# EAGLE schematic Max10-Brd-v1 (EAGLE 9.2.2)
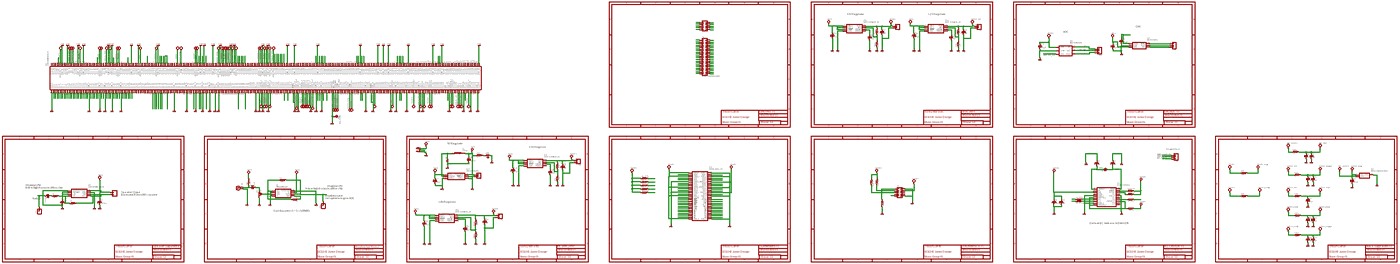
[diagram p0: schematic, sheet 1, overview]
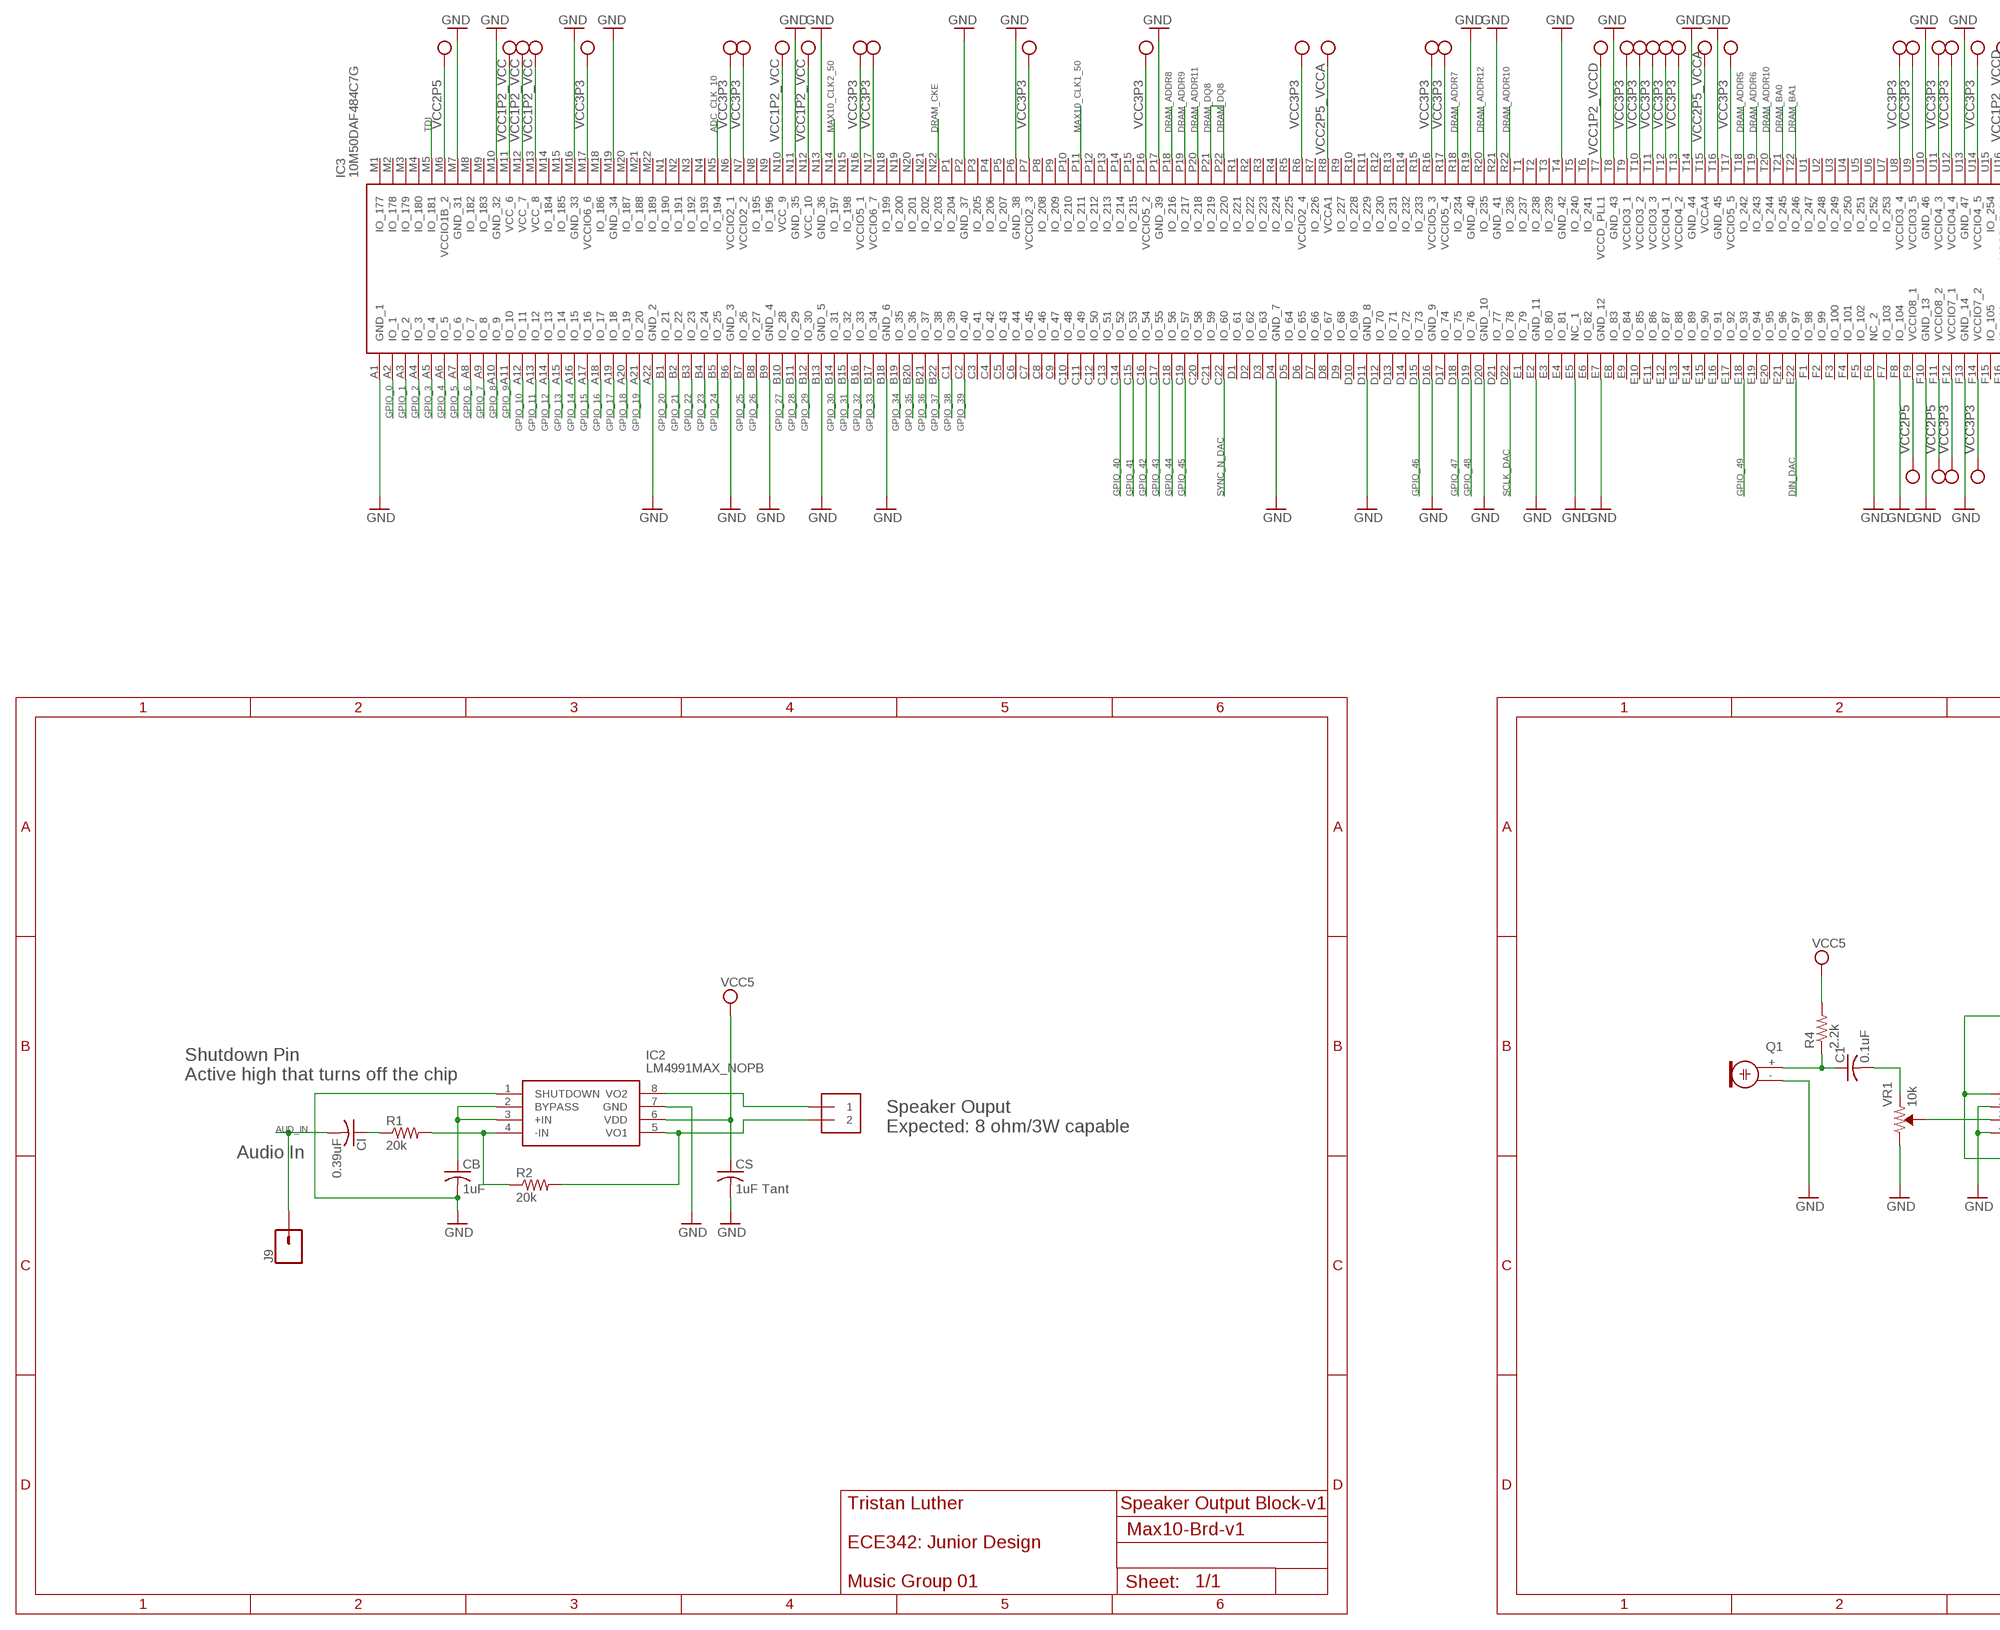
[diagram p1: schematic, sheet 1, part 1 of 6]
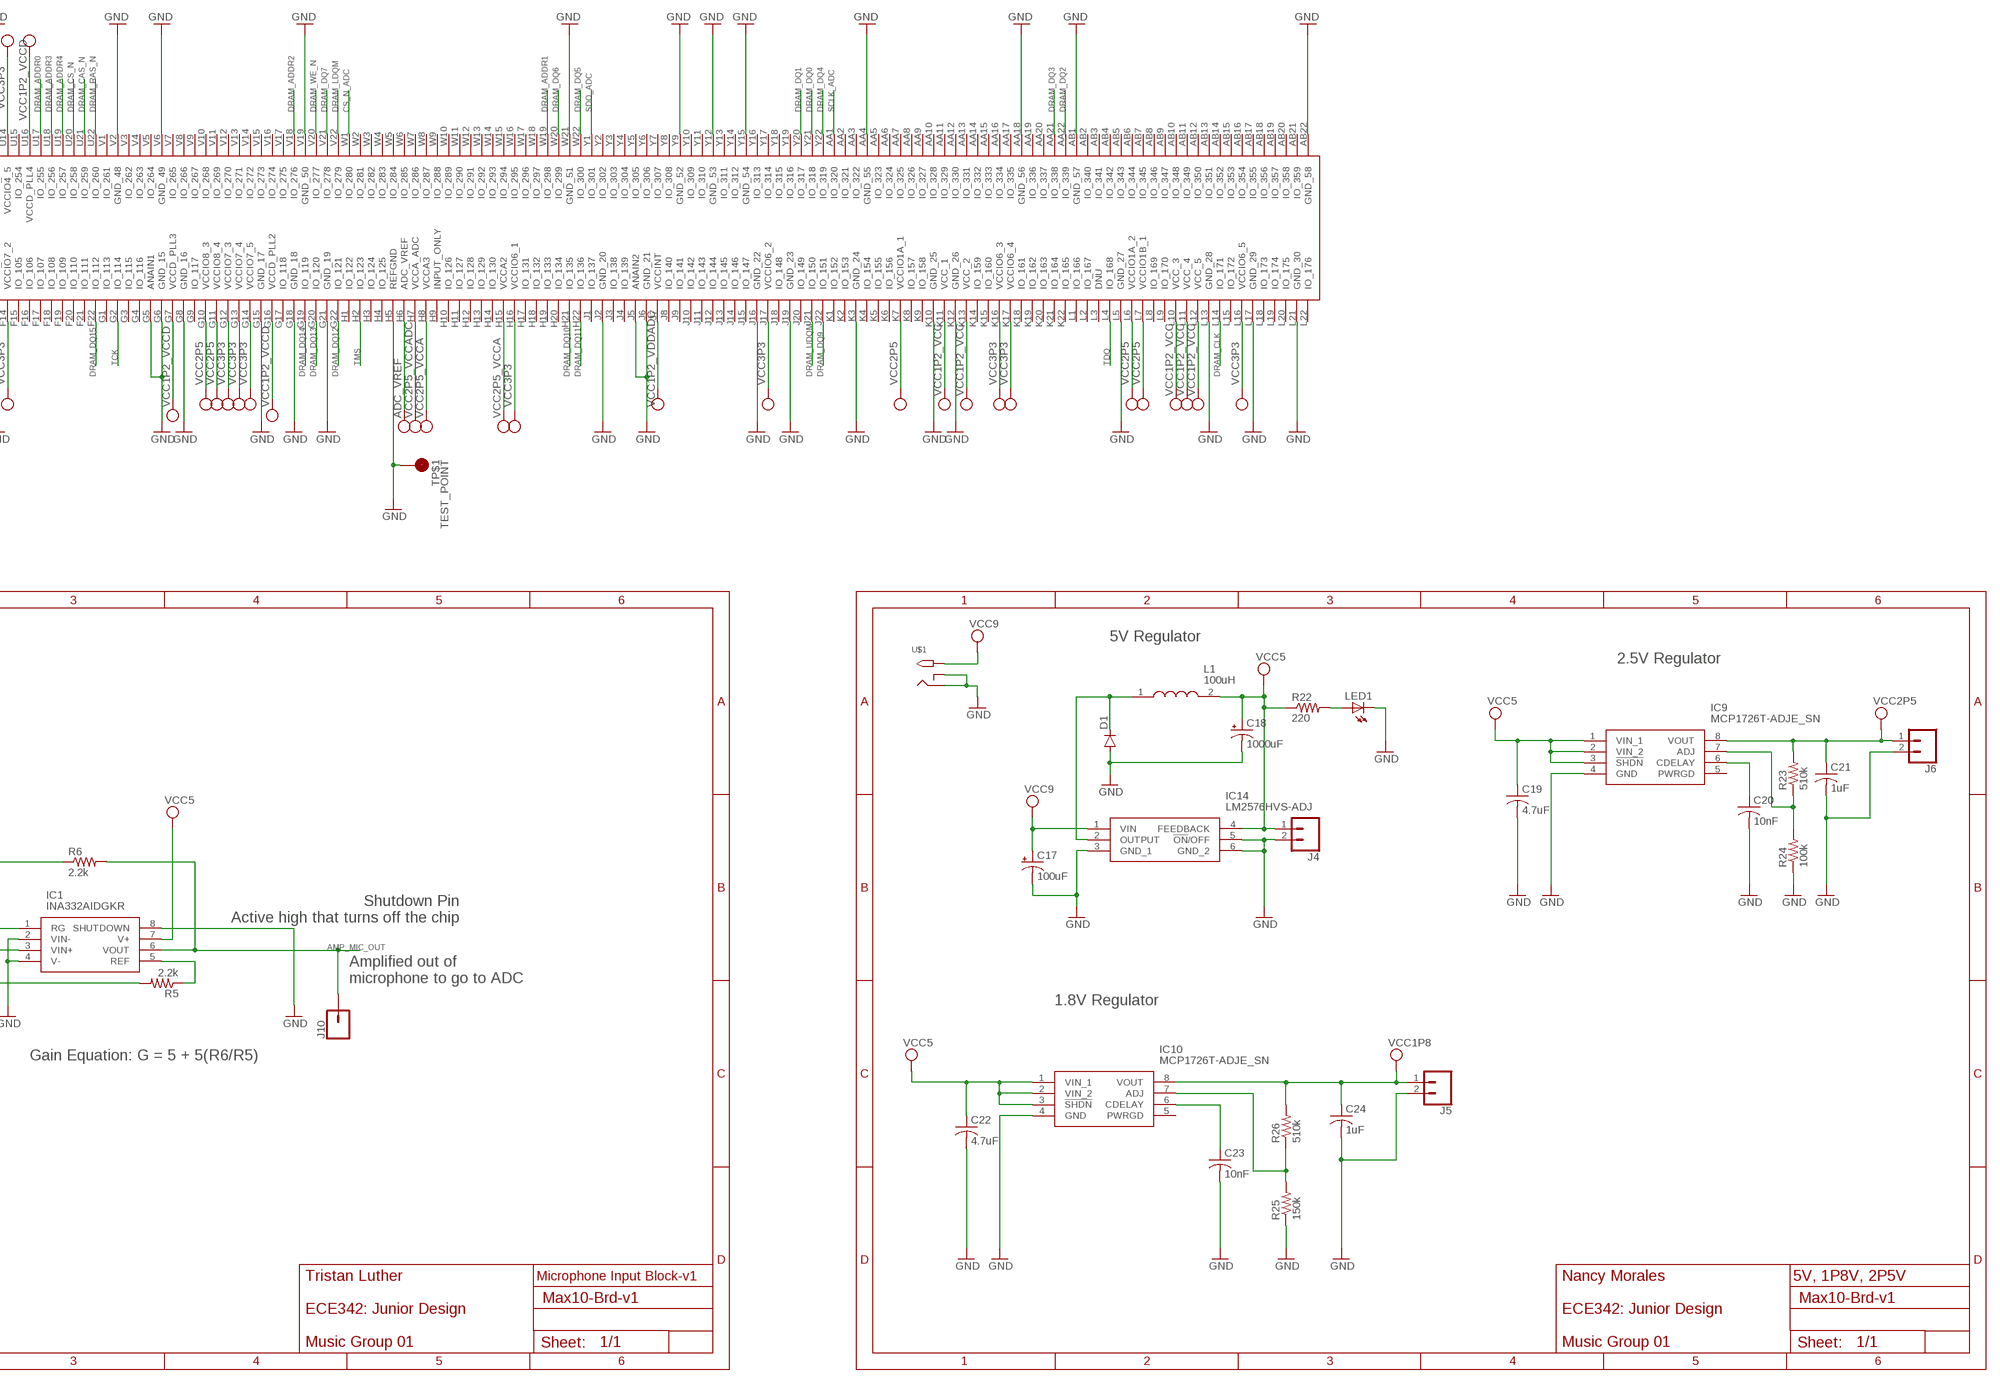
[diagram p2: schematic, sheet 1, part 2 of 6]
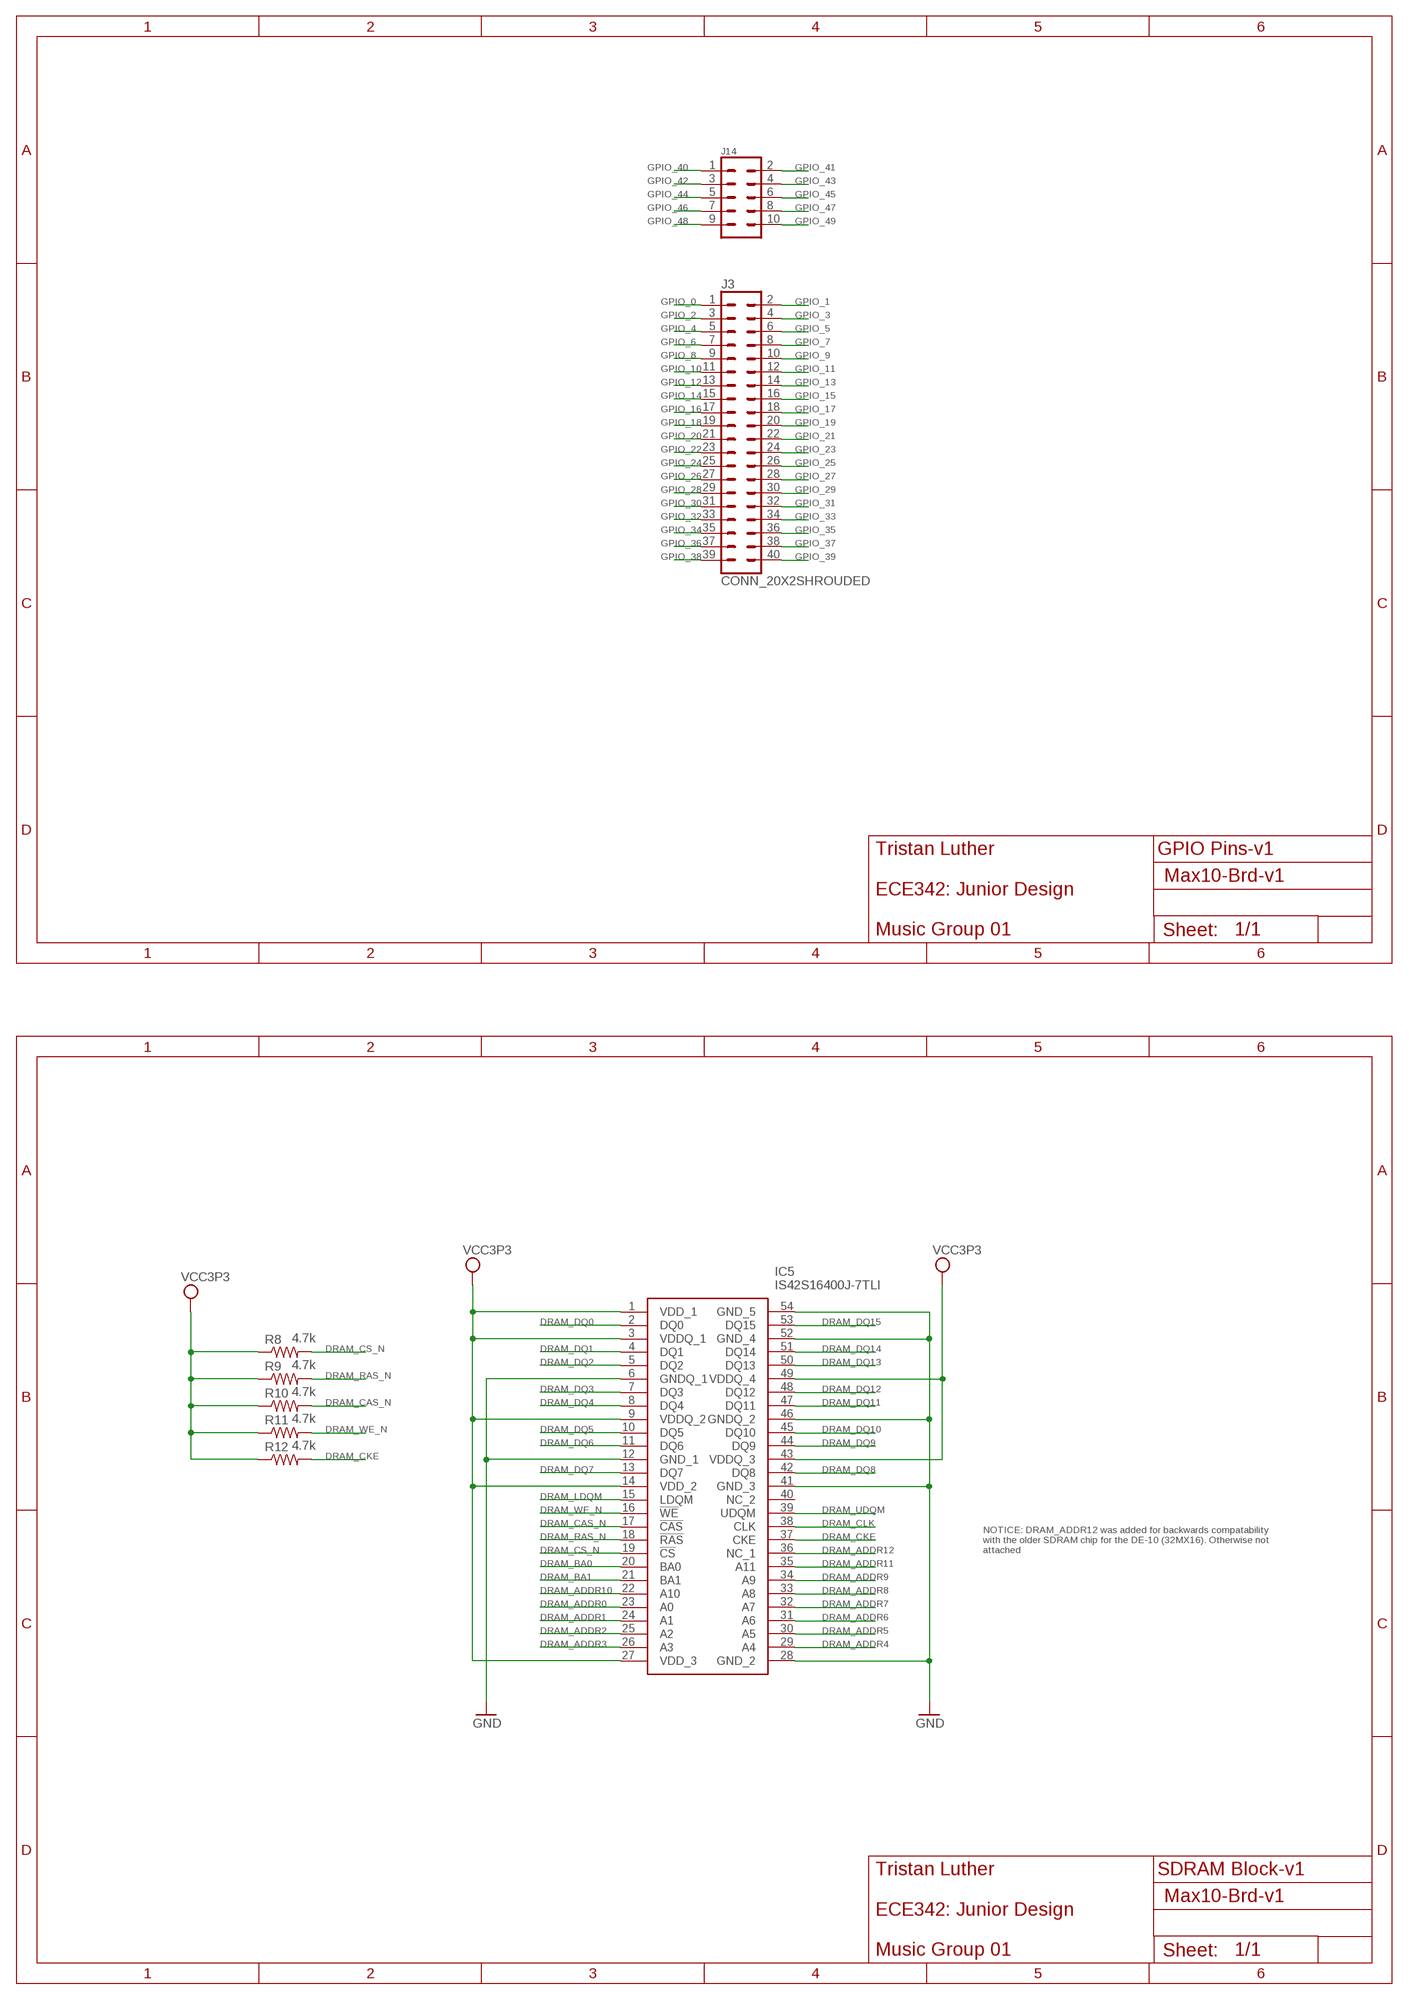
[diagram p3: schematic, sheet 1, part 3 of 6]
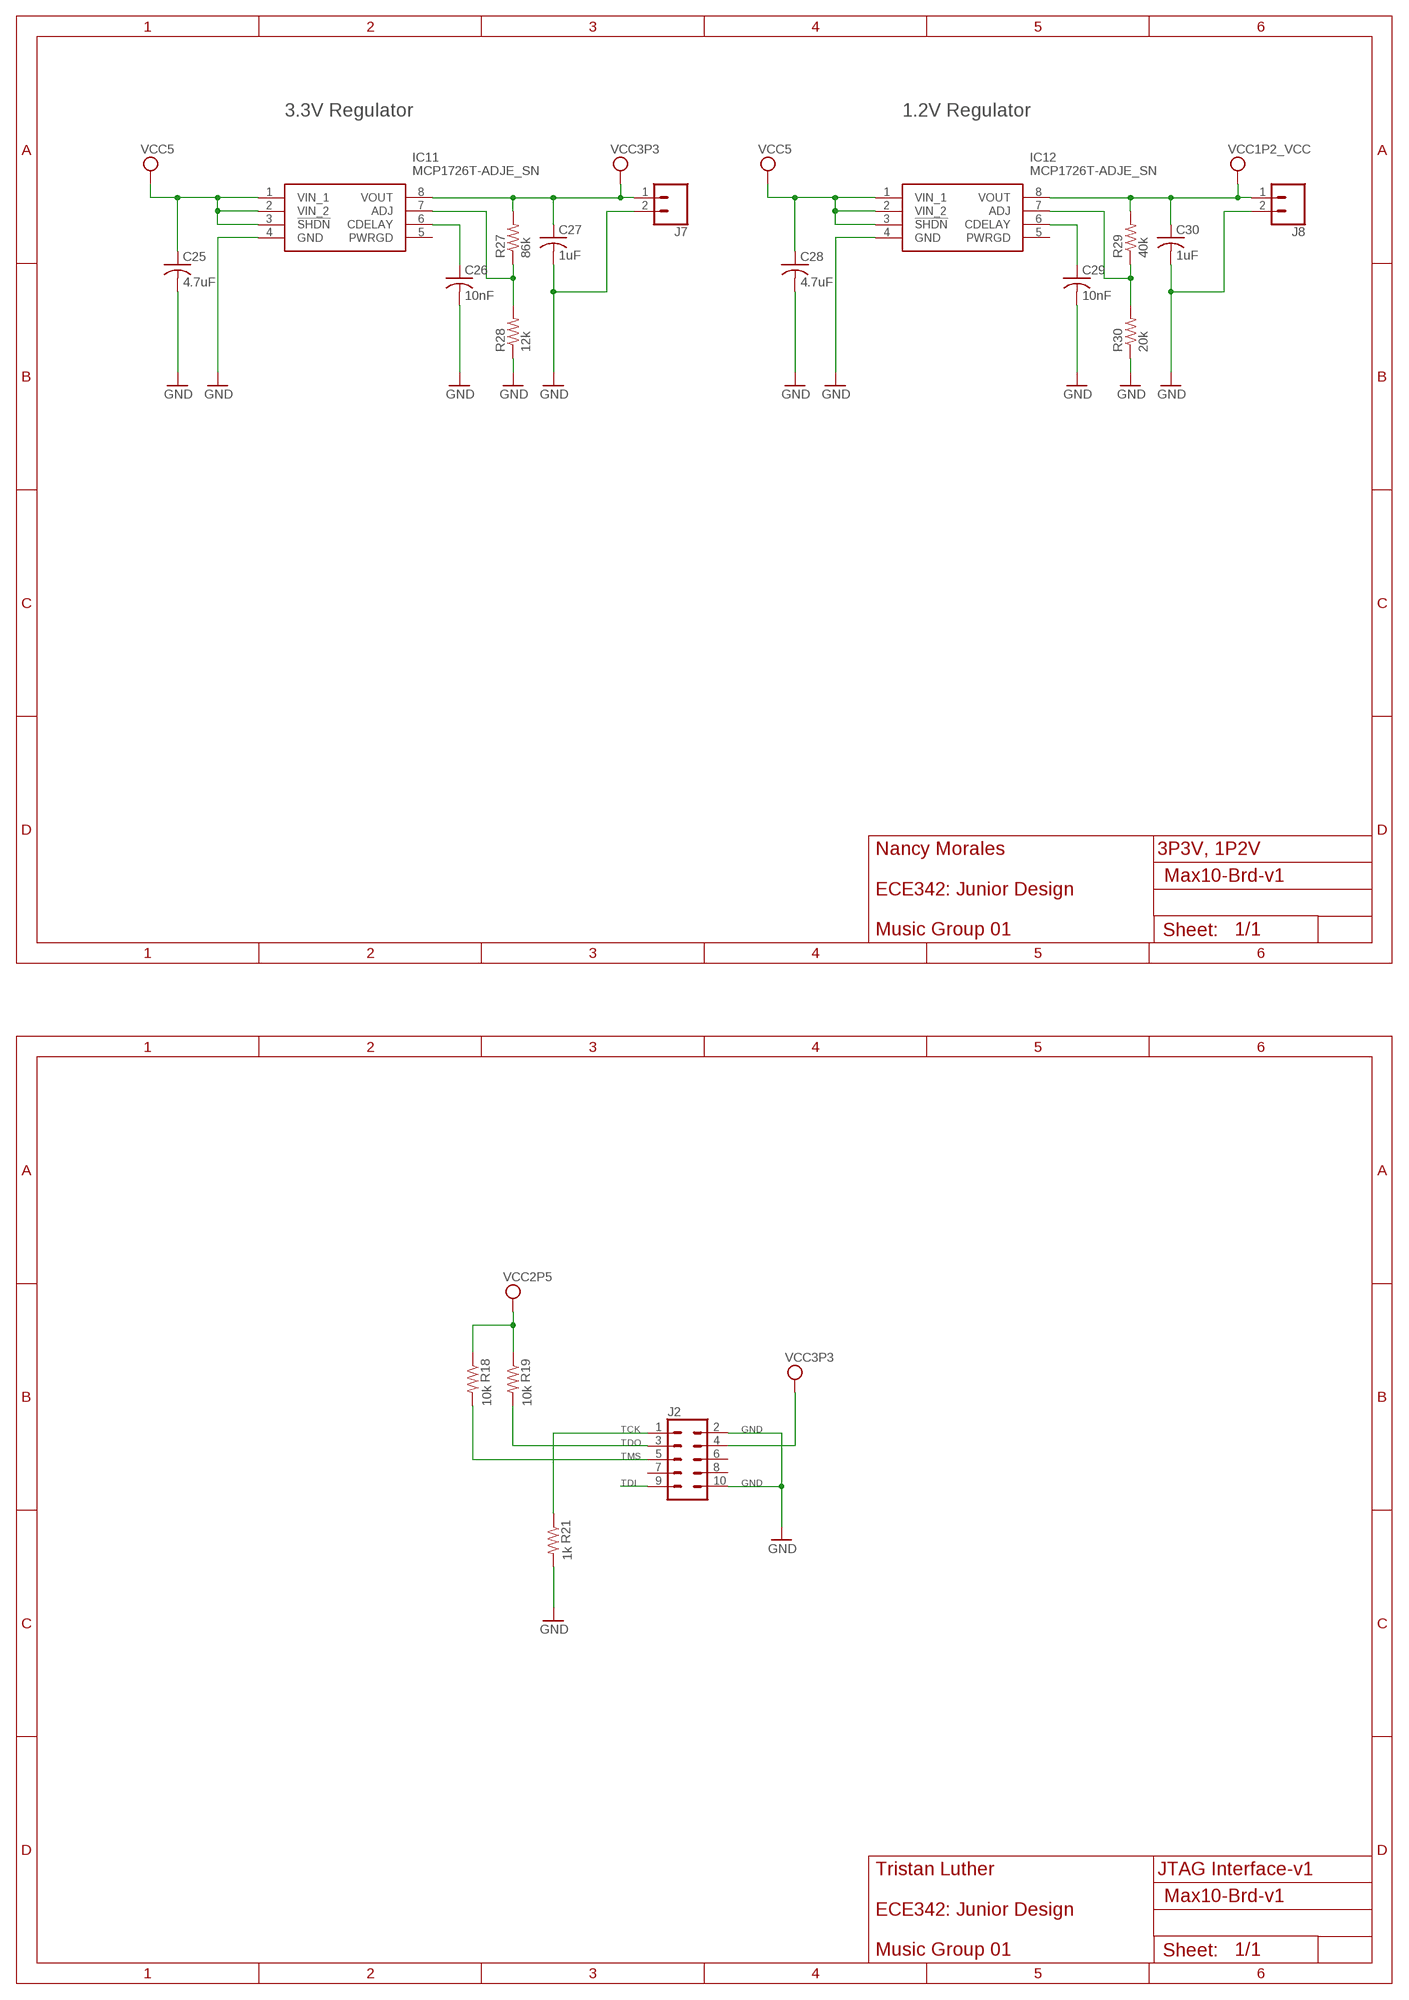
[diagram p4: schematic, sheet 1, part 4 of 6]
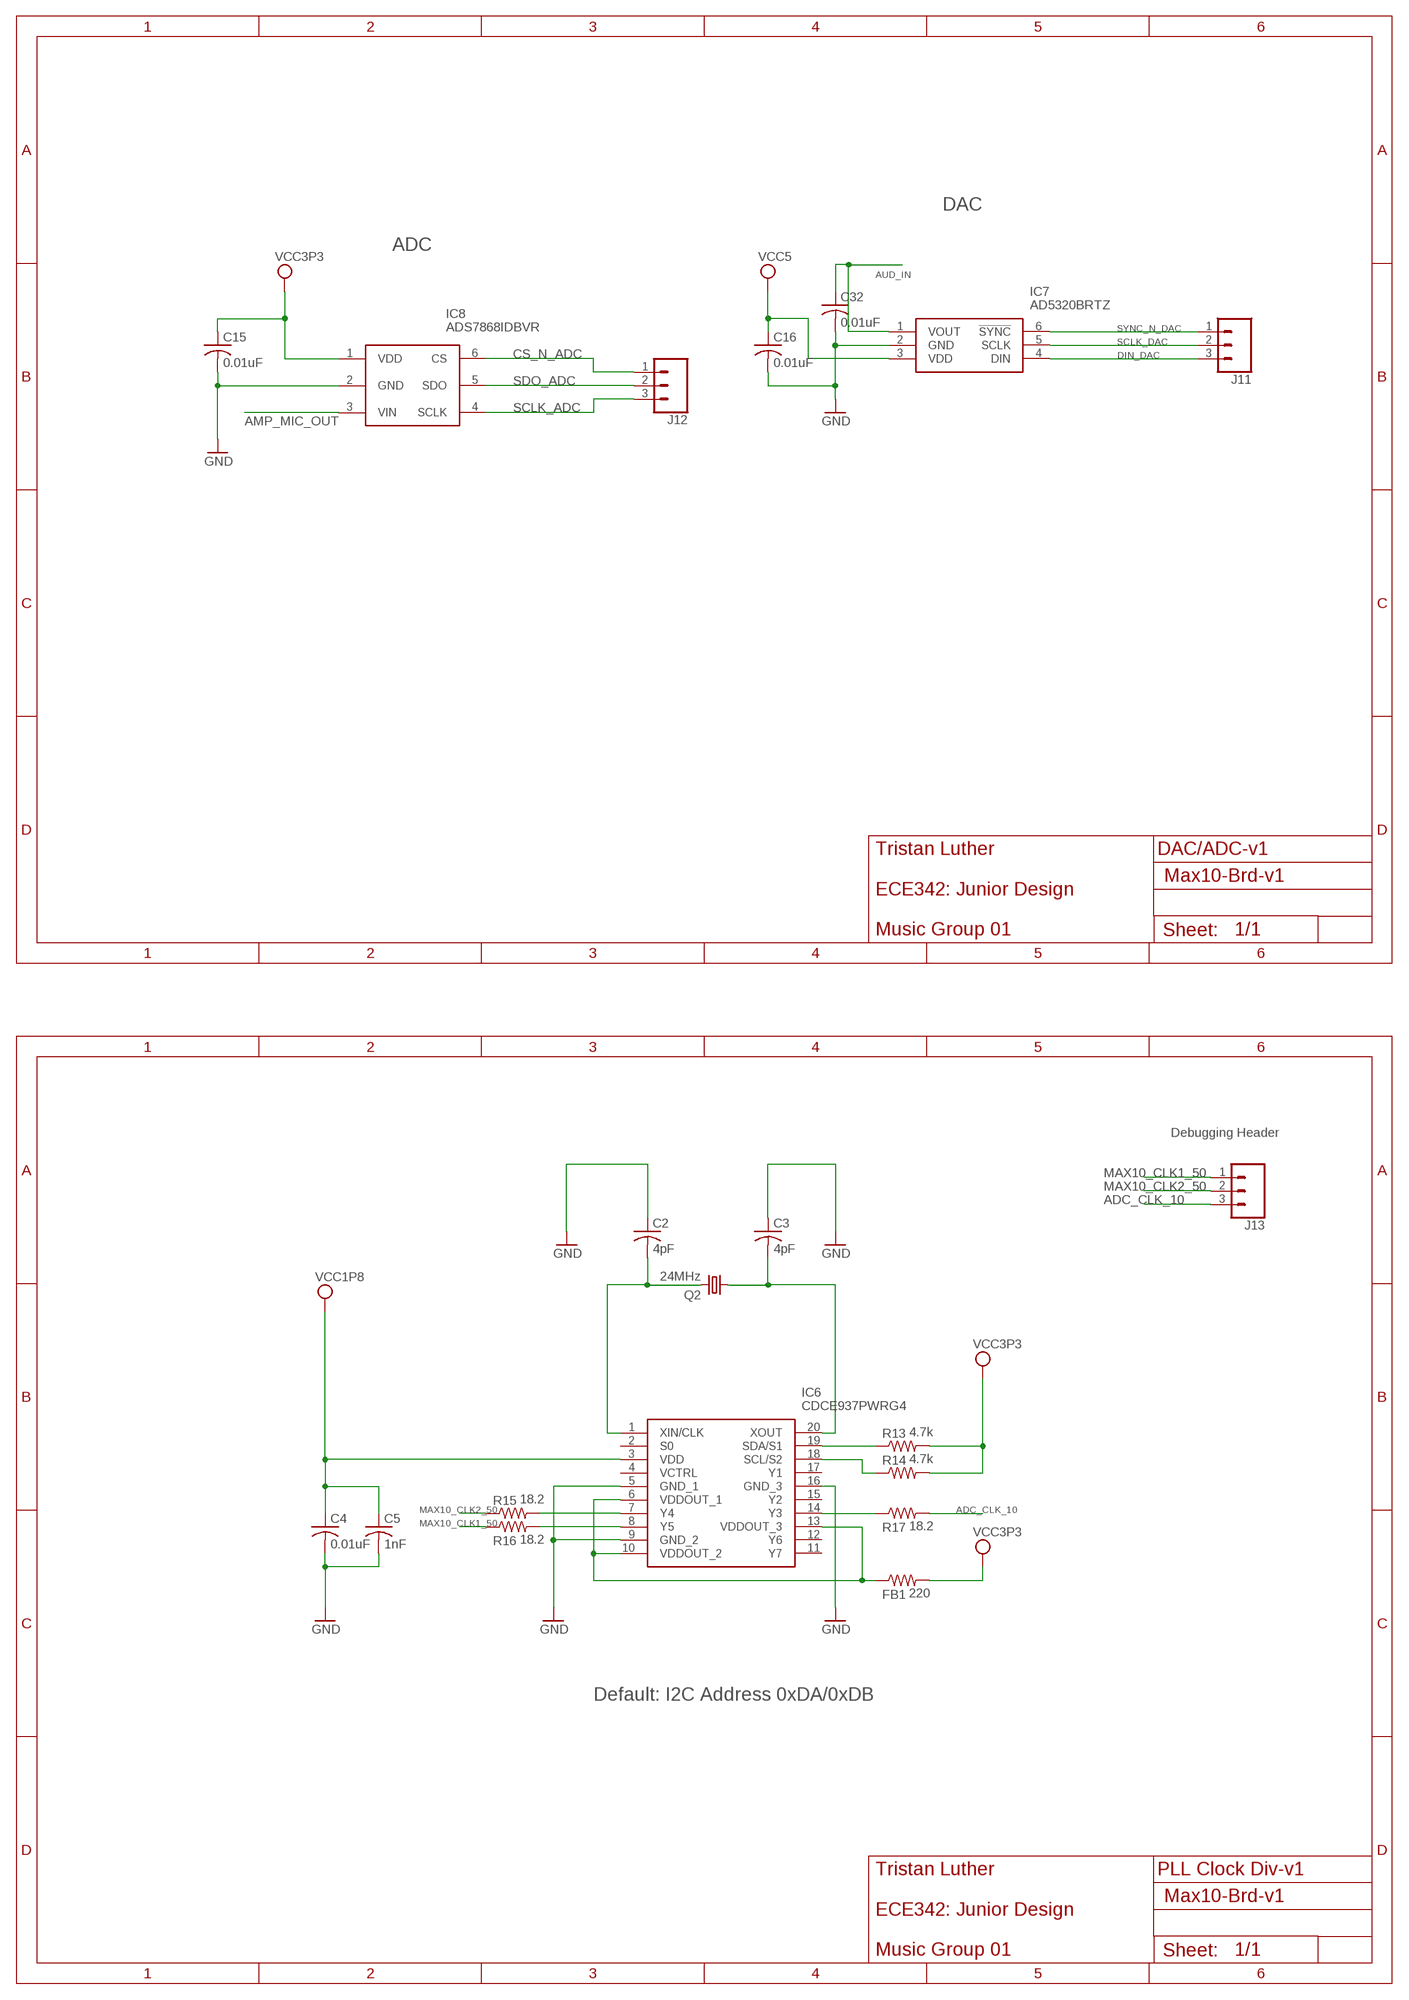
[diagram p5: schematic, sheet 1, part 5 of 6]
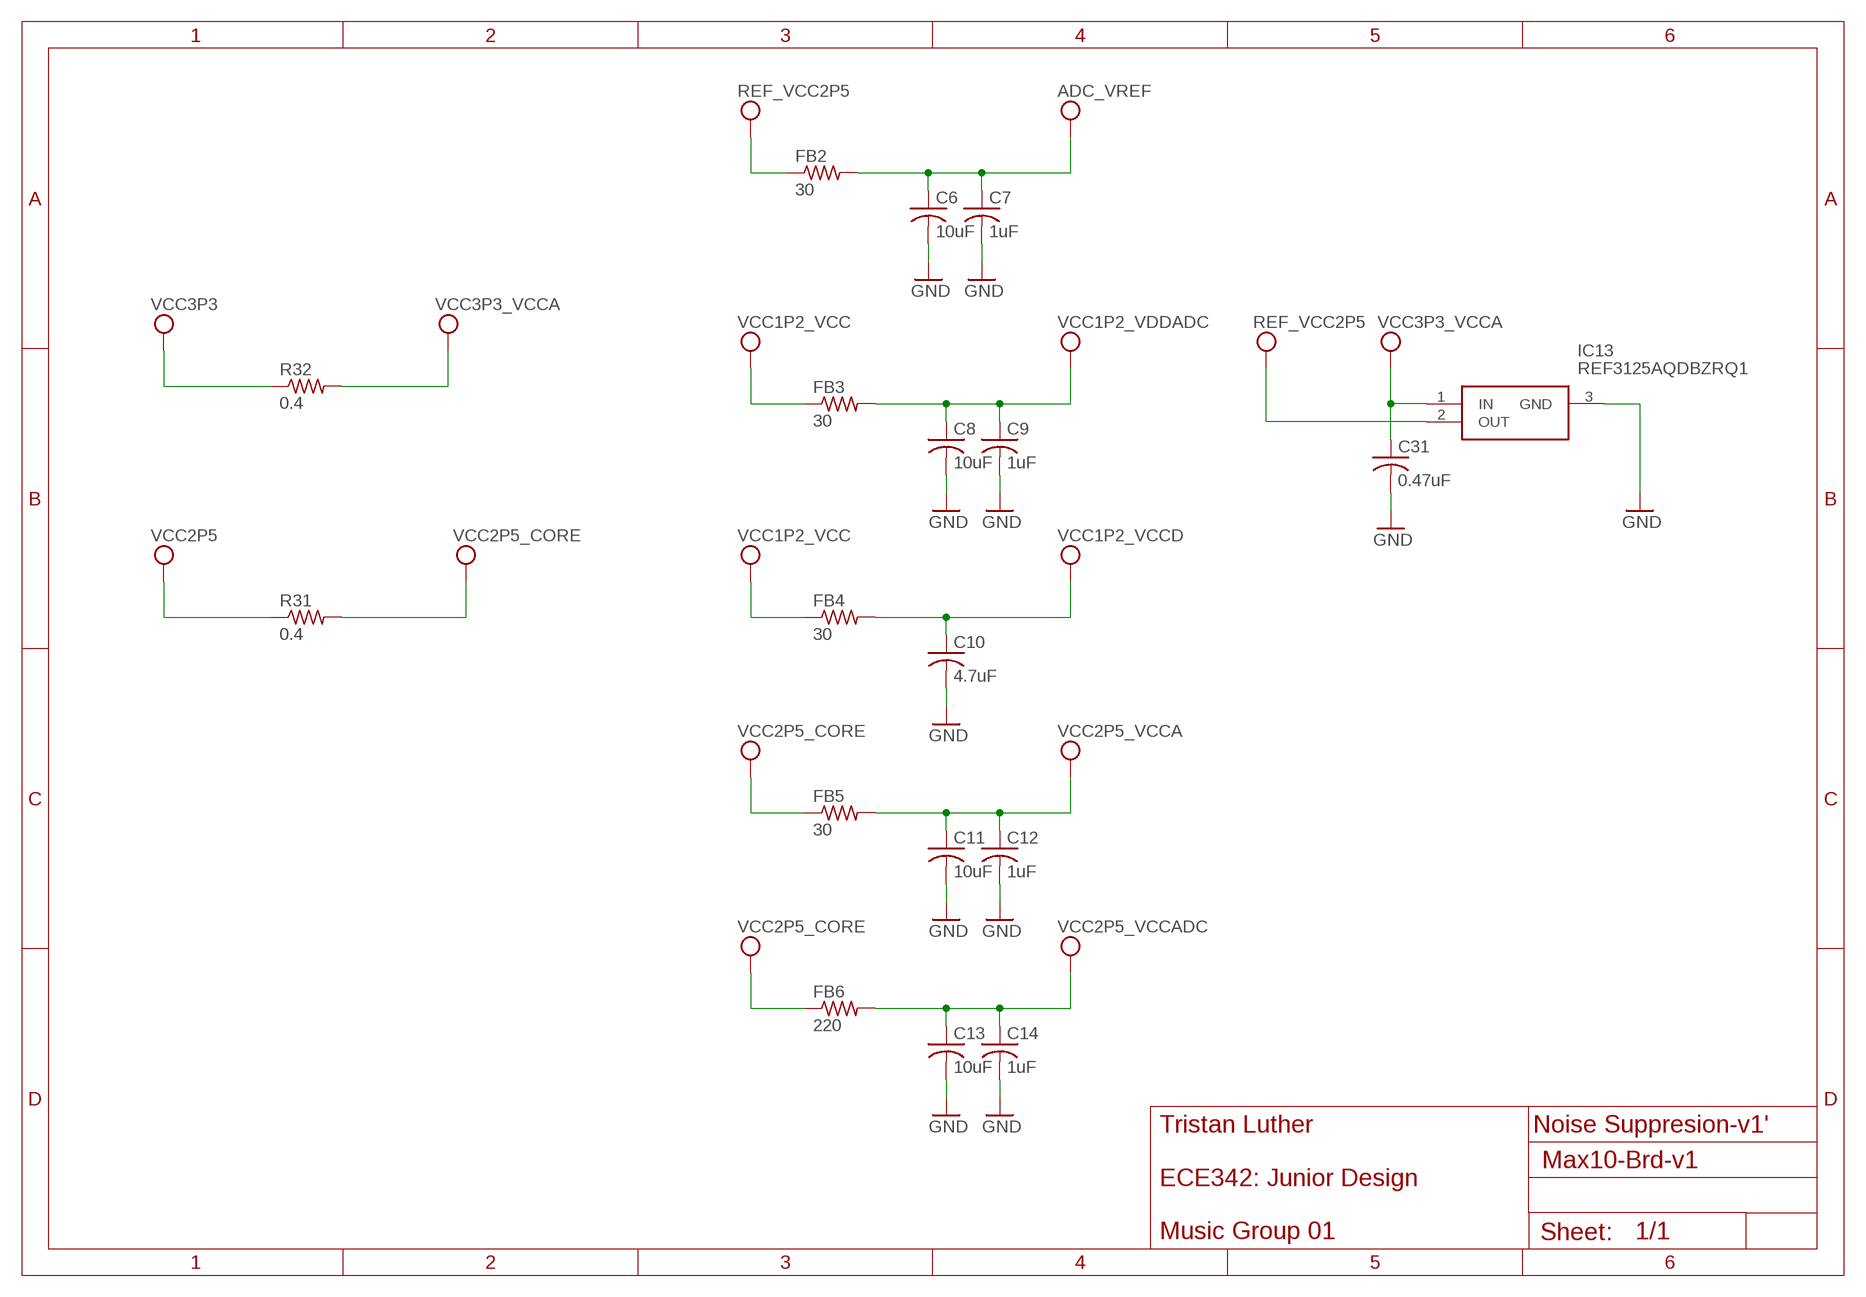
[diagram p6: schematic, sheet 1, part 6 of 6]

## Parts
C1  0.1uF  C-USC0805  [C0805]
C2  4pF  C-USC0805  [C0805]
C3  4pF  C-USC0805  [C0805]
C4  0.01uF  C-USC0805  [C0805]
C5  1nF  C-USC0805  [C0805]
C6  10uF  C-USC0805  [C0805]
C7  1uF  C-USC0805  [C0805]
C8  10uF  C-USC0805  [C0805]
C9  1uF  C-USC0805  [C0805]
C10  4.7uF  C-USC0805  [C0805]
C11  10uF  C-USC0805  [C0805]
C12  1uF  C-USC0805  [C0805]
C13  10uF  C-USC0805  [C0805]
C14  1uF  C-USC0805  [C0805]
C15  0.01uF  C-USC0805  [C0805]
C16  0.01uF  C-USC0805  [C0805]
C17  100uF  CPOL-USE5-6  [E5-6]
C18  1000uF  CPOL-USE3.5-10  [E3,5-10]
C19  4.7uF  C-USC0805  [C0805]
C20  10nF  C-USC0805  [C0805]
C21  1uF  C-USC0805  [C0805]
C22  4.7uF  C-USC0805  [C0805]
C23  10nF  C-USC0805  [C0805]
C24  1uF  C-USC0805  [C0805]
C25  4.7uF  C-USC0805  [C0805]
C26  10nF  C-USC0805  [C0805]
C27  1uF  C-USC0805  [C0805]
C28  4.7uF  C-USC0805  [C0805]
C29  10nF  C-USC0805  [C0805]
C30  1uF  C-USC0805  [C0805]
C31  0.47uF  C-USC0805  [C0805]
C32  0.01uF  C-USC0805  [C0805]
CB  1uF  C-USC0805  [C0805]
CI  0.39uF  C-USC0805  [C0805]
CS  1uF Tant  C-US050-075X075  [C050-075X075]
D1  DIODE-DO201-15  [DO201-15]
FB1  220  R-US_M0805  [M0805]
FB2  30  R-US_M0805  [M0805]
FB3  30  R-US_M0805  [M0805]
FB4  30  R-US_M0805  [M0805]
FB5  30  R-US_M0805  [M0805]
FB6  220  R-US_M0805  [M0805]
IC1  INA332AIDGKR  [SOP65P490X110-8N]
IC2  LM4991MAX_NOPB  [SOIC127P600X175-8N]
IC3  10M50DAF484C7G  [BGA484C100P22X22_2300X2300X200]
IC5  IS42S16400J-7TLI  [SOP80P1176X120-54N]
IC6  CDCE937PWRG4  [SOP65P640X120-20N]
IC7  AD5320BRTZ  [SOT95P280X145-6N]
IC8  ADS7868IDBVR  [SOT95P280X145-6N]
IC9  MCP1726T-ADJE_SN  [SOIC127P600X175-8N]
IC10  MCP1726T-ADJE_SN  [SOIC127P600X175-8N]
IC11  MCP1726T-ADJE_SN  [SOIC127P600X175-8N]
IC12  MCP1726T-ADJE_SN  [SOIC127P600X175-8N]
IC13  REF3125AQDBZRQ1  [SOT95P237X112-3N]
IC14  LM2576HVS-ADJ  [KTT0005B]
J1  1X2-3.5MM  [1X2-3.5MM]
J2  CONN_05X2SHD  [2X5-SHROUDED]
J3  CONN_20X2SHROUDED  [2X20_SHROUDED]
J4  CONN_02  [1X02]
J5  CONN_02  [1X02]
J6  CONN_02  [1X02]
J7  CONN_02  [1X02]
J8  CONN_02  [1X02]
J9  CONN_01  [1X01]
J10  CONN_01  [1X01]
J11  CONN_03  [1X03]
J12  CONN_03  [1X03]
J13  CONN_03  [1X03]
J14  CONN_05X2SHD  [2X5-SHROUDED]
L1  100uH  SRR1260-680M  [INDPM125125X650N]
LED1  LED3MM  [LED3MM]
Q1  ELECTRET  [9.7ELECTRET]
Q2  24MHz  CRYSTALCTS406  [CTS406]
R1  20k  R-US_M0805  [M0805]
R2  20k  R-US_M0805  [M0805]
R4  2.2k  R-US_M0805  [M0805]
R5  2.2k  R-US_M0805  [M0805]
R6  2.2k  R-US_M0805  [M0805]
R8  4.7k  R-US_M0805  [M0805]
R9  4.7k  R-US_M0805  [M0805]
R10  4.7k  R-US_M0805  [M0805]
R11  4.7k  R-US_M0805  [M0805]
R12  4.7k  R-US_M0805  [M0805]
R13  4.7k  R-US_M0805  [M0805]
R14  4.7k  R-US_M0805  [M0805]
R15  18.2  R-US_M0805  [M0805]
R16  18.2  R-US_M0805  [M0805]
R17  18.2  R-US_M0805  [M0805]
R18  10k  R-US_M0805  [M0805]
R19  10k  R-US_M0805  [M0805]
R21  1k  R-US_M0805  [M0805]
R22  220  R-US_R0805  [R0805]
R23  510k  R-US_R0805  [R0805]
R24  100k  R-US_R0805  [R0805]
R25  150k  R-US_R0805  [R0805]
R26  510k  R-US_R0805  [R0805]
R27  86k  R-US_R0805  [R0805]
R28  12k  R-US_R0805  [R0805]
R29  40k  R-US_R0805  [R0805]
R30  20k  R-US_R0805  [R0805]
R31  0.4  R-US_M0805  [M0805]
R32  0.4  R-US_M0805  [M0805]
TP$1  TEST_POINT  [TEST_POINT]
U$1  2.1MMJACKTHM  [PJ-102A]
VR1  10k  TRIMPOT-PTH-10MM-KNOB-1/2W-10%  [TRIMPOT-PTH-3386U]

## Nets
ADC_CLK_10: IC3.N5(IO_194) J13.3 R17.2
ADC_VREF: C6.1 C7.1 FB2.2 IC3.H6(ADC_VREF)
AMP_MIC_OUT: IC1.6(VOUT) IC8.3(VIN) J10.1 R6.2
AUD_IN: C32.1 CI.2 IC7.1(VOUT) J9.1
CS_N_ADC: IC3.W1(IO_280) IC8.6(CS) J12.1
DIN_DAC: IC3.E22(IO_97) IC7.4(DIN) J11.3
DRAM_ADDR0: IC3.U17(IO_255) IC5.23(A0)
DRAM_ADDR1: IC3.W19(IO_298) IC5.24(A1)
DRAM_ADDR2: IC3.V18(IO_276) IC5.25(A2)
DRAM_ADDR3: IC3.U18(IO_256) IC5.26(A3)
DRAM_ADDR4: IC3.U19(IO_257) IC5.29(A4)
DRAM_ADDR5: IC3.T18(IO_242) IC5.30(A5)
DRAM_ADDR6: IC3.T19(IO_243) IC5.31(A6)
DRAM_ADDR7: IC3.R18(IO_234) IC5.32(A7)
DRAM_ADDR8: IC3.P18(IO_216) IC5.33(A8)
DRAM_ADDR9: IC3.P19(IO_217) IC5.34(A9)
DRAM_ADDR10: IC3.R22(IO_236) IC3.T20(IO_244) IC5.22(A10)
DRAM_ADDR11: IC3.P20(IO_218) IC5.35(A11)
DRAM_ADDR12: IC3.R20(IO_235) IC5.36(NC_1)
DRAM_BA0: IC3.T21(IO_245) IC5.20(BA0)
DRAM_BA1: IC3.T22(IO_246) IC5.21(BA1)
DRAM_CAS_N: IC3.U21(IO_259) IC5.17(!CAS) R10.2
DRAM_CKE: IC3.N22(IO_203) IC5.37(CKE) R12.2
DRAM_CLK: IC3.L14(IO_171) IC5.38(CLK)
DRAM_CS_N: IC3.U20(IO_258) IC5.19(!CS) R8.2
DRAM_DQ0: IC3.Y21(IO_318) IC5.2(DQ0)
DRAM_DQ1: IC3.Y20(IO_317) IC5.4(DQ1)
DRAM_DQ2: IC3.AA22(IO_339) IC5.5(DQ2)
DRAM_DQ3: IC3.AA21(IO_338) IC5.7(DQ3)
DRAM_DQ4: IC3.Y22(IO_319) IC5.8(DQ4)
DRAM_DQ5: IC3.W22(IO_300) IC5.10(DQ5)
DRAM_DQ6: IC3.W20(IO_299) IC5.11(DQ6)
DRAM_DQ7: IC3.V21(IO_278) IC5.13(DQ7)
DRAM_DQ8: IC3.P21(IO_219) IC3.P22(IO_220) IC5.42(DQ8)
DRAM_DQ9: IC3.J22(IO_151) IC5.44(DQ9)
DRAM_DQ10: IC3.H21(IO_135) IC5.45(DQ10)
DRAM_DQ11: IC3.H22(IO_136) IC5.47(DQ11)
DRAM_DQ12: IC3.G22(IO_121) IC5.48(DQ12)
DRAM_DQ13: IC3.G20(IO_120) IC5.50(DQ13)
DRAM_DQ14: IC3.G19(IO_119) IC5.51(DQ14)
DRAM_DQ15: IC3.F22(IO_112) IC5.53(DQ15)
DRAM_LDQM: IC3.V22(IO_279) IC5.15(LDQM)
DRAM_RAS_N: IC3.U22(IO_260) IC5.18(!RAS) R9.2
DRAM_UDQM: IC3.J21(IO_150) IC5.39(UDQM)
DRAM_WE_N: IC3.V20(IO_277) IC5.16(!WE) R11.2
GND: C2.1 C3.1 C4.2 C5.2 C6.2 C7.2 C8.2 C9.2 C10.2 C11.2 C12.2 C13.2 C14.2 C15.2 C16.2 C17.- C18.- C19.2 C20.2 C21.2 C22.2 C23.2 C24.2 C25.2 C26.2 C27.2 C28.2 C29.2 C30.2 C31.2 C32.2 CB.2 CS.2 D1.A IC1.2(VIN-) IC1.4(V-) IC1.8(SHUTDOWN) IC2.1(SHUTDOWN) IC2.7(GND) IC3.A1(GND_1) IC3.A22(GND_2) IC3.AA4(GND_55) IC3.AA18(GND_56) IC3.AB1(GND_57) IC3.AB22(GND_58) IC3.B6(GND_3) IC3.B9(GND_4) IC3.B13(GND_5) IC3.B18(GND_6) IC3.D4(GND_7) IC3.D11(GND_8) IC3.D16(GND_9) IC3.D20(GND_10) IC3.E2(GND_11) IC3.E5(NC_1) IC3.E7(GND_12) IC3.F6(NC_2) IC3.F8(IO_104) IC3.F10(GND_13) IC3.F13(GND_14) IC3.G5(ANAIN1) IC3.G6(GND_15) IC3.G8(GND_16) IC3.G15(GND_17) IC3.G18(GND_18) IC3.G21(GND_19) IC3.H5(REFGND) IC3.J2(GND_20) IC3.J5(ANAIN2) IC3.J6(GND_21) IC3.J16(GND_22) IC3.J19(GND_23) IC3.K3(GND_24) IC3.K10(GND_25) IC3.K12(GND_26) IC3.L5(GND_27) IC3.L13(GND_28) IC3.L17(GND_29) IC3.L21(GND_30) IC3.M7(GND_31) IC3.M10(GND_32) IC3.M16(GND_33) IC3.M19(GND_34) IC3.N11(GND_35) IC3.N13(GND_36) IC3.P2(GND_37) IC3.P6(GND_38) IC3.P17(GND_39) IC3.R19(GND_40) IC3.R21(GND_41) IC3.T4(GND_42) IC3.T8(GND_43) IC3.T14(GND_44) IC3.T16(GND_45) IC3.U10(GND_46) IC3.U13(GND_47) IC3.V2(GND_48) IC3.V6(GND_49) IC3.V19(GND_50) IC3.W21(GND_51) IC3.Y9(GND_52) IC3.Y12(GND_53) IC3.Y15(GND_54) IC5.6(GNDQ_1) IC5.12(GND_1) IC5.28(GND_2) IC5.41(GND_3) IC5.46(GNDQ_2) IC5.52(GND_4) IC5.54(GND_5) IC6.5(GND_1) IC6.9(GND_2) IC6.16(GND_3) IC7.2(GND) IC8.2(GND) IC9.4(GND) IC10.4(GND) IC11.4(GND) IC12.4(GND) IC13.3(GND) IC14.3(GND_1) IC14.5(!ON!/OFF) IC14.6(GND_2) J2.2 J2.10 J4.2 J5.2 J6.2 J7.2 J8.2 LED1.K(C) Q1.- R21.2 R24.1 R25.1 R28.1 R30.1 TP$1.TP1(TP) U$1.RING U$1.RING_SW VR1.3(CW)
GPIO_0: IC3.A2(IO_1) J3.1
GPIO_1: IC3.A3(IO_2) J3.2
GPIO_2: IC3.A4(IO_3) J3.3
GPIO_3: IC3.A5(IO_4) J3.4
GPIO_4: IC3.A6(IO_5) J3.5
GPIO_5: IC3.A7(IO_6) J3.6
GPIO_6: IC3.A8(IO_7) J3.7
GPIO_7: IC3.A9(IO_8) J3.8
GPIO_8: IC3.A10(IO_9) J3.9
GPIO_9: IC3.A11(IO_10) J3.10
GPIO_10: IC3.A12(IO_11) J3.11
GPIO_11: IC3.A13(IO_12) J3.12
GPIO_12: IC3.A14(IO_13) J3.13
GPIO_13: IC3.A15(IO_14) J3.14
GPIO_14: IC3.A16(IO_15) J3.15
GPIO_15: IC3.A17(IO_16) J3.16
GPIO_16: IC3.A18(IO_17) J3.17
GPIO_17: IC3.A19(IO_18) J3.18
GPIO_18: IC3.A20(IO_19) J3.19
GPIO_19: IC3.A21(IO_20) J3.20
GPIO_20: IC3.B1(IO_21) J3.21
GPIO_21: IC3.B2(IO_22) J3.22
GPIO_22: IC3.B3(IO_23) J3.23
GPIO_23: IC3.B4(IO_24) J3.24
GPIO_24: IC3.B5(IO_25) J3.25
GPIO_25: IC3.B7(IO_26) J3.26
GPIO_26: IC3.B8(IO_27) J3.27
GPIO_27: IC3.B10(IO_28) J3.28
GPIO_28: IC3.B11(IO_29) J3.29
GPIO_29: IC3.B12(IO_30) J3.30
GPIO_30: IC3.B14(IO_31) J3.31
GPIO_31: IC3.B15(IO_32) J3.32
GPIO_32: IC3.B16(IO_33) J3.33
GPIO_33: IC3.B17(IO_34) J3.34
GPIO_34: IC3.B19(IO_35) J3.35
GPIO_35: IC3.B20(IO_36) J3.36
GPIO_36: IC3.B21(IO_37) J3.37
GPIO_37: IC3.B22(IO_38) J3.38
GPIO_38: IC3.C1(IO_39) J3.39
GPIO_39: IC3.C2(IO_40) J3.40
GPIO_40: IC3.C14(IO_52) J14.1
GPIO_41: IC3.C15(IO_53) J14.2
GPIO_42: IC3.C16(IO_54) J14.3
GPIO_43: IC3.C17(IO_55) J14.4
GPIO_44: IC3.C18(IO_56) J14.5
GPIO_45: IC3.C19(IO_57) J14.6
GPIO_46: IC3.D15(IO_73) J14.7
GPIO_47: IC3.D18(IO_75) J14.8
GPIO_48: IC3.D19(IO_76) J14.9
GPIO_49: IC3.E18(IO_93) J14.10
MAX10_CLK1_50: IC3.P11(IO_211) J13.1 R16.1
MAX10_CLK2_50: IC3.N14(IO_197) J13.2 R15.1
N$1: IC2.4(-IN) R1.2 R2.1
N$2: CI.1 R1.1
N$3: IC6.14(Y3) R17.1
N$4: CB.1 IC2.2(BYPASS) IC2.3(+IN)
N$5: IC2.5(VO1) J1.2 R2.2
N$6: IC2.8(VO2) J1.1
N$7: LED1.A R22.2
N$8: C1.1 Q1.+ R4.1
N$9: C1.2 VR1.1(CCW)
N$10: IC1.5(REF) R5.1
N$11: IC1.1(RG) R5.2 R6.1
N$12: IC9.7(ADJ) R23.1 R24.2
N$13: IC1.3(VIN+) VR1.2(WIPER)
N$14: C2.2 IC6.1(XIN/CLK) Q2.3
N$15: C3.2 IC6.20(XOUT) Q2.1
N$16: IC6.19(SDA/S1) R13.1
N$17: IC6.18(SCL/S2) R14.1
N$18: IC6.7(Y4) R15.2
N$19: IC6.8(Y5) R16.2
N$20: FB1.1 IC6.6(VDDOUT_1) IC6.10(VDDOUT_2) IC6.13(VDDOUT_3)
N$21: D1.C IC14.2(OUTPUT) L1.1
N$22: IC11.7(ADJ) R27.1 R28.2
N$23: C26.1 IC11.6(CDELAY)
N$24: IC12.7(ADJ) R29.1 R30.2
N$25: C29.1 IC12.6(CDELAY)
N$26: C23.1 IC10.6(CDELAY)
N$27: C20.1 IC9.6(CDELAY)
N$30: IC10.7(ADJ) R25.2 R26.1
REF_VCC2P5: FB2.1 IC13.2(OUT)
SCLK_ADC: IC3.AA1(IO_320) IC8.4(SCLK) J12.3
SCLK_DAC: IC3.D22(IO_78) IC7.5(SCLK) J11.2
SDO_ADC: IC3.Y1(IO_301) IC8.5(SDO) J12.2
SYNC_N_DAC: IC3.C22(IO_60) IC7.6(!SYNC) J11.1
TCK: IC3.G2(IO_114) J2.1 R21.1
TDI: IC3.M5(IO_181) J2.9
TDO: IC3.L4(IO_168) J2.3 R19.2
TMS: IC3.H2(IO_123) J2.5 R18.2
VCC1P2_VCC: C30.1 FB3.1 FB4.1 IC3.K11(VCC_1) IC3.K13(VCC_2) IC3.L10(VCC_3) IC3.L11(VCC_4) IC3.L12(VCC_5) IC3.M11(VCC_6) IC3.M12(VCC_7) IC3.M13(VCC_8) IC3.N10(VCC_9) IC3.N12(VCC_10) IC12.8(VOUT) J8.1 R29.2
VCC1P2_VCCD: C10.1 FB4.2 IC3.G7(VCCD_PLL3) IC3.G16(VCCD_PLL2) IC3.T7(VCCD_PLL1) IC3.U16(VCCD_PLL4)
VCC1P2_VDDADC: C8.1 C9.1 FB3.2 IC3.J7(VCCINT)
VCC1P8: C4.1 C5.1 C24.1 IC6.3(VDD) IC10.8(VOUT) J5.1 R26.2
VCC2P5: C21.1 IC3.F9(VCCIO8_1) IC3.F11(VCCIO8_2) IC3.G10(VCCIO8_3) IC3.G11(VCCIO8_4) IC3.K7(VCCIO1A_1) IC3.L6(VCCIO1A_2) IC3.L7(VCCIO1B_1) IC3.M6(VCCIO1B_2) IC9.8(VOUT) J6.1 R18.1 R19.1 R23.2 R31.1
VCC2P5_CORE: FB5.1 FB6.1 R31.2
VCC2P5_VCCA: C11.1 C12.1 FB5.2 IC3.H8(VCCA3) IC3.H15(VCCA2) IC3.R8(VCCA1) IC3.T15(VCCA4)
VCC2P5_VCCADC: C13.1 C14.1 FB6.2 IC3.H7(VCCA_ADC)
VCC3P3: C15.1 C27.1 FB1.2 IC3.F12(VCCIO7_1) IC3.F14(VCCIO7_2) IC3.G12(VCCIO7_3) IC3.G13(VCCIO7_4) IC3.G14(VCCIO7_5) IC3.H16(VCCIO6_1) IC3.J17(VCCIO6_2) IC3.K16(VCCIO6_3) IC3.K17(VCCIO6_4) IC3.L16(VCCIO6_5) IC3.M17(VCCIO6_6) IC3.N6(VCCIO2_1) IC3.N7(VCCIO2_2) IC3.N16(VCCIO5_1) IC3.N17(VCCIO6_7) IC3.P7(VCCIO2_3) IC3.P16(VCCIO5_2) IC3.R6(VCCIO2_4) IC3.R16(VCCIO5_3) IC3.R17(VCCIO5_4) IC3.T9(VCCIO3_1) IC3.T10(VCCIO3_2) IC3.T11(VCCIO3_3) IC3.T12(VCCIO4_1) IC3.T13(VCCIO4_2) IC3.T17(VCCIO5_5) IC3.U8(VCCIO3_4) IC3.U9(VCCIO3_5) IC3.U11(VCCIO4_3) IC3.U12(VCCIO4_4) IC3.U14(VCCIO4_5) IC5.1(VDD_1) IC5.3(VDDQ_1) IC5.9(VDDQ_2) IC5.14(VDD_2) IC5.27(VDD_3) IC5.43(VDDQ_3) IC5.49(VDDQ_4) IC8.1(VDD) IC11.8(VOUT) J2.4 J7.1 R8.1 R9.1 R10.1 R11.1 R12.1 R13.2 R14.2 R27.2 R32.1
VCC3P3_VCCA: C31.1 IC13.1(IN) R32.2
VCC5: C16.1 C18.+ C19.1 C22.1 C25.1 C28.1 CS.1 IC1.7(V+) IC2.6(VDD) IC7.3(VDD) IC9.1(VIN_1) IC9.2(VIN_2) IC9.3(!SHDN) IC10.1(VIN_1) IC10.2(VIN_2) IC10.3(!SHDN) IC11.1(VIN_1) IC11.2(VIN_2) IC11.3(!SHDN) IC12.1(VIN_1) IC12.2(VIN_2) IC12.3(!SHDN) IC14.4(FEEDBACK) J4.1 L1.2 R4.2 R22.1
VCC9: C17.+ IC14.1(VIN) U$1.TIP
Unconnected: IC3.AA2(IO_321) IC3.AA3(IO_322) IC3.AA5(IO_323) IC3.AA6(IO_324) IC3.AA7(IO_325) IC3.AA8(IO_326) IC3.AA9(IO_327) IC3.AA10(IO_328) IC3.AA11(IO_329) IC3.AA12(IO_330) IC3.AA13(IO_331) IC3.AA14(IO_332) IC3.AA15(IO_333) IC3.AA16(IO_334) IC3.AA17(IO_335) IC3.AA19(IO_336) IC3.AA20(IO_337) IC3.AB2(IO_340) IC3.AB3(IO_341) IC3.AB4(IO_342) IC3.AB5(IO_343) IC3.AB6(IO_344) IC3.AB7(IO_345) IC3.AB8(IO_346) IC3.AB9(IO_347) IC3.AB10(IO_348) IC3.AB11(IO_349) IC3.AB12(IO_350) IC3.AB13(IO_351) IC3.AB14(IO_352) IC3.AB15(IO_353) IC3.AB16(IO_354) IC3.AB17(IO_355) IC3.AB18(IO_356) IC3.AB19(IO_357) IC3.AB20(IO_358) IC3.AB21(IO_359) IC3.C3(IO_41) IC3.C4(IO_42) IC3.C5(IO_43) IC3.C6(IO_44) IC3.C7(IO_45) IC3.C8(IO_46) IC3.C9(IO_47) IC3.C10(IO_48) IC3.C11(IO_49) IC3.C12(IO_50) IC3.C13(IO_51) IC3.C20(IO_58) IC3.C21(IO_59) IC3.D1(IO_61) IC3.D2(IO_62) IC3.D3(IO_63) IC3.D5(IO_64) IC3.D6(IO_65) IC3.D7(IO_66) IC3.D8(IO_67) IC3.D9(IO_68) IC3.D10(IO_69) IC3.D12(IO_70) IC3.D13(IO_71) IC3.D14(IO_72) IC3.D17(IO_74) IC3.D21(IO_77) IC3.E1(IO_79) IC3.E3(IO_80) IC3.E4(IO_81) IC3.E6(IO_82) IC3.E8(IO_83) IC3.E9(IO_84) IC3.E10(IO_85) IC3.E11(IO_86) IC3.E12(IO_87) IC3.E13(IO_88) IC3.E14(IO_89) IC3.E15(IO_90) IC3.E16(IO_91) IC3.E17(IO_92) IC3.E19(IO_94) IC3.E20(IO_95) IC3.E21(IO_96) IC3.F1(IO_98) IC3.F2(IO_99) IC3.F3(IO_100) IC3.F4(IO_101) IC3.F5(IO_102) IC3.F7(IO_103) IC3.F15(IO_105) IC3.F16(IO_106) IC3.F17(IO_107) IC3.F18(IO_108) IC3.F19(IO_109) IC3.F20(IO_110) IC3.F21(IO_111) IC3.G1(IO_113) IC3.G3(IO_115) IC3.G4(IO_116) IC3.G9(IO_117) IC3.G17(IO_118) IC3.H1(IO_122) IC3.H3(IO_124) IC3.H4(IO_125) IC3.H9(INPUT_ONLY) IC3.H10(IO_126) IC3.H11(IO_127) IC3.H12(IO_128) IC3.H13(IO_129) IC3.H14(IO_130) IC3.H17(IO_131) IC3.H18(IO_132) IC3.H19(IO_133) IC3.H20(IO_134) IC3.J1(IO_137) IC3.J3(IO_138) IC3.J4(IO_139) IC3.J8(IO_140) IC3.J9(IO_141) IC3.J10(IO_142) IC3.J11(IO_143) IC3.J12(IO_144) IC3.J13(IO_145) IC3.J14(IO_146) IC3.J15(IO_147) IC3.J18(IO_148) IC3.J20(IO_149) IC3.K1(IO_152) IC3.K2(IO_153) IC3.K4(IO_154) IC3.K5(IO_155) IC3.K6(IO_156) IC3.K8(IO_157) IC3.K9(IO_158) IC3.K14(IO_159) IC3.K15(IO_160) IC3.K18(IO_161) IC3.K19(IO_162) IC3.K20(IO_163) IC3.K21(IO_164) IC3.K22(IO_165) IC3.L1(IO_166) IC3.L2(IO_167) IC3.L3(DNU) IC3.L8(IO_169) IC3.L9(IO_170) IC3.L15(IO_172) IC3.L18(IO_173) IC3.L19(IO_174) IC3.L20(IO_175) IC3.L22(IO_176) IC3.M1(IO_177) IC3.M2(IO_178) IC3.M3(IO_179) IC3.M4(IO_180) IC3.M8(IO_182) IC3.M9(IO_183) IC3.M14(IO_184) IC3.M15(IO_185) IC3.M18(IO_186) IC3.M20(IO_187) IC3.M21(IO_188) IC3.M22(IO_189) IC3.N1(IO_190) IC3.N2(IO_191) IC3.N3(IO_192) IC3.N4(IO_193) IC3.N8(IO_195) IC3.N9(IO_196) IC3.N15(IO_198) IC3.N18(IO_199) IC3.N19(IO_200) IC3.N20(IO_201) IC3.N21(IO_202) IC3.P1(IO_204) IC3.P3(IO_205) IC3.P4(IO_206) IC3.P5(IO_207) IC3.P8(IO_208) IC3.P9(IO_209) IC3.P10(IO_210) IC3.P12(IO_212) IC3.P13(IO_213) IC3.P14(IO_214) IC3.P15(IO_215) IC3.R1(IO_221) IC3.R2(IO_222) IC3.R3(IO_223) IC3.R4(IO_224) IC3.R5(IO_225) IC3.R7(IO_226) IC3.R9(IO_227) IC3.R10(IO_228) IC3.R11(IO_229) IC3.R12(IO_230) IC3.R13(IO_231) IC3.R14(IO_232) IC3.R15(IO_233) IC3.T1(IO_237) IC3.T2(IO_238) IC3.T3(IO_239) IC3.T5(IO_240) IC3.T6(IO_241) IC3.U1(IO_247) IC3.U2(IO_248) IC3.U3(IO_249) IC3.U4(IO_250) IC3.U5(IO_251) IC3.U6(IO_252) IC3.U7(IO_253) IC3.U15(IO_254) IC3.V1(IO_261) IC3.V3(IO_262) IC3.V4(IO_263) IC3.V5(IO_264) IC3.V7(IO_265) IC3.V8(IO_266) IC3.V9(IO_267) IC3.V10(IO_268) IC3.V11(IO_269) IC3.V12(IO_270) IC3.V13(IO_271) IC3.V14(IO_272) IC3.V15(IO_273) IC3.V16(IO_274) IC3.V17(IO_275) IC3.W2(IO_281) IC3.W3(IO_282) IC3.W4(IO_283) IC3.W5(IO_284) IC3.W6(IO_285) IC3.W7(IO_286) IC3.W8(IO_287) IC3.W9(IO_288) IC3.W10(IO_289) IC3.W11(IO_290) IC3.W12(IO_291) IC3.W13(IO_292) IC3.W14(IO_293) IC3.W15(IO_294) IC3.W16(IO_295) IC3.W17(IO_296) IC3.W18(IO_297) IC3.Y2(IO_302) IC3.Y3(IO_303) IC3.Y4(IO_304) IC3.Y5(IO_305) IC3.Y6(IO_306) IC3.Y7(IO_307) IC3.Y8(IO_308) IC3.Y10(IO_309) IC3.Y11(IO_310) IC3.Y13(IO_311) IC3.Y14(IO_312) IC3.Y16(IO_313) IC3.Y17(IO_314) IC3.Y18(IO_315) IC3.Y19(IO_316) IC5.40(NC_2) IC6.2(S0) IC6.4(VCTRL) IC6.11(Y7) IC6.12(Y6) IC6.15(Y2) IC6.17(Y1) IC9.5(PWRGD) IC10.5(PWRGD) IC11.5(PWRGD) IC12.5(PWRGD) J2.6 J2.7 J2.8

## Notes on the sheet
- 3.3V Regulator | 1.2V Regulator
- DAC
- ADC
- GPIO Pins-v1 | 3P3V, 1P2V | DAC/ADC-v1
- Tristan Luther
  
  ECE342: Junior Design
  
  Music Group 01
- Nancy Morales
  
  ECE342: Junior Design
  
  Music Group 01
- Tristan Luther
  
  ECE342: Junior Design
  
  Music Group 01
- 5V Regulator
- 2.5V Regulator
- Debugging Header
- Shutdown Pin
  Active high that turns off the chip
- Shutdown Pin
  Active high that turns off the chip
- Speaker Ouput
  Expected: 8 ohm/3W capable
- Audio In
- Amplified out of 
  microphone to go to ADC
- 1.8V Regulator
- NOTICE: DRAM_ADDR12 was added for backwards compatability
  with the older SDRAM chip for the DE-10 (32MX16). Otherwise not
  attached
- Gain Equation: G = 5 + 5(R6/R5)
- Default: I2C Address 0xDA/0xDB
- Speaker Output Block-v1 | Microphone Input Block-v1 | 5V, 1P8V, 2P5V | SDRAM Block-v1 | JTAG Interface-v1 | PLL Clock Div-v1 | Noise Suppresion-v1'
- Tristan Luther
  
  ECE342: Junior Design
  
  Music Group 01
- Tristan Luther
  
  ECE342: Junior Design
  
  Music Group 01
- Nancy Morales
  
  ECE342: Junior Design
  
  Music Group 01
- Tristan Luther
  
  ECE342: Junior Design
  
  Music Group 01
- Tristan Luther
  
  ECE342: Junior Design
  
  Music Group 01
- Tristan Luther
  
  ECE342: Junior Design
  
  Music Group 01
- Tristan Luther
  
  ECE342: Junior Design
  
  Music Group 01

## Library data of the parts
C1-C16 C19-C32 CB CI CS = adafruit:C-US: CAPACITOR, American symbol
C17 C18 = adafruit:CPOL-US: POLARIZED CAPACITOR, American symbol
D1 = diode:DIODE-: DIODE
FB1-FB6 R1 R2 R4-R6 R8-R19 R21-R32 = adafruit:R-US_: RESISTOR, American symbol
IC1 = SamacSys_Parts:INA332AIDGKR: Low-Power, Single Supply, CMOS, Low Cost, Instumentation Amplifier Source: Datasheet <http://www.ti.com/lit/ds/symlink/ina2332.pdf>; DESCRIPTION: Low-Power, Single Supply, CMOS, Low Cost, Instumentation Amplifier; HEIGHT: 1.1mm; MANUFACTURER_NAME: Texas Instruments; MANUFACTURER_PART_NUMBER: INA332AIDGKR; MOUSER_PART_NUMBER: 595-INA332AIDGKR; MOUSER_PRICE-STOCK: https://www.mouser.com/Search/Refine.aspx?Keyword=595-INA332AIDGKR
IC2 = SamacSys_Parts:LM4991MAX_NOPB: 3W Audio Power Amplifier with Shutdown Mode Source: Datasheet <http://www.ti.com/lit/gpn/LM4991>; DESCRIPTION: 3W Audio Power Amplifier with Shutdown Mode; HEIGHT: 1.75mm; MANUFACTURER_NAME: Texas Instruments; MANUFACTURER_PART_NUMBER: LM4991MAX/NOPB; MOUSER_PART_NUMBER: 926-LM4991MAX/NOPB; MOUSER_PRICE-STOCK: https://www.mouser.com/Search/Refine.aspx?Keyword=926-LM4991MAX%2FNOPB
IC3 = SamacSys_Parts:10M50DAF484C7G: FPGA - Field Programmable Gate Array non-volatile FPGA, 360 I/O, 484FBGA Source: Datasheet <https://www.altera.com/en_US/pdfs/literature/hb/max-10/m10_overview.pdf>; DESCRIPTION: FPGA - Field Programmable Gate Array non-volatile FPGA, 360 I/O, 484FBGA; HEIGHT: 2mm; MANUFACTURER_NAME: Intel; MANUFACTURER_PART_NUMBER: 10M50DAF484C7G; MOUSER_PART_NUMBER: 989-10M50DAF484C7G; MOUSER_PRICE-STOCK: https://www.mouser.com/Search/Refine.aspx?Keyword=989-10M50DAF484C7G
IC5 = SamacSys_Parts:IS42S16400J-7TLI: IS42S16400J-7TLI, SDRAM Memory 64Mbit Surface Mount, 143MHz, 3 3.6 V, -40 +85 C, 54-Pin, TSOP Source: Datasheet <http://www.issi.com/WW/pdf/42-45S16400J.pdf>; DESCRIPTION: IS42S16400J-7TLI, SDRAM Memory 64Mbit Surface Mount, 143MHz, 3 3.6 V, -40 +85 C, 54-Pin, TSOP; HEIGHT: 1.2mm; MANUFACTURER_NAME: Integrated Silicon Solution Inc.; MANUFACTURER_PART_NUMBER: IS42S16400J-7TLI; MOUSER_PART_NUMBER: 870-IS42S16400J-7TLI; MOUSER_PRICE-STOCK: https://www.mouser.com/Search/Refine.aspx?Keyword=870-IS42S16400J-7TLI; RS_PART_NUMBER: 8115125P; RS_PRICE-STOCK: http://uk.rs-online.com/web/p/products/8115125P
IC6 = SamacSys_Parts:CDCE937PWRG4: Clock Synthesizer / Jitter Cleaner Programmable 3-PLL VCXO Clock Synth Source: Datasheet <http://www.ti.com/general/docs/suppproductinfo.tsp?distId=10&gotoUrl=http://www.ti.com/lit/gpn/cdce937>; DESCRIPTION: Clock Synthesizer / Jitter Cleaner Programmable 3-PLL VCXO Clock Synth; HEIGHT: 1.2mm; MANUFACTURER_NAME: Texas Instruments; MANUFACTURER_PART_NUMBER: CDCE937PWRG4; MOUSER_PART_NUMBER: 595-CDCE937PWRG4; MOUSER_PRICE-STOCK: https://www.mouser.com/Search/Refine.aspx?Keyword=595-CDCE937PWRG4
IC7 = SamacSys_Parts:AD5320BRTZ: AD5320BRTZ Source: Datasheet <http://docs-emea.rs-online.com/webdocs/077f/0900766b8077ff0f.pdf>; DESCRIPTION: AD5320BRTZ; HEIGHT: 1.45mm; MANUFACTURER_NAME: Analog Devices; MANUFACTURER_PART_NUMBER: AD5320BRTZ; MOUSER_PART_NUMBER: N/A; MOUSER_PRICE-STOCK: https://www.mouser.com/Search/Refine.aspx?Keyword=N%2FA
IC8 = MyLibrary:ADS7868IDBVR: ADS7868IDBVR - 1.2-V, 12-/10-/8-BIT, 200-KSPS/100-KSPS, MICRO-POWER, MINIATURE ANALOG-TO-DIGITAL CONVERTER WITH SERIAL INTERFACE. Datasheet <http://www.ti.com/lit/ds/symlink/ads7868.pdf>
IC9-IC12 = SamacSys_Parts:MCP1726T-ADJE_SN: LDO Voltage Regulators 1A CMOS LDO Source: Datasheet <http://ww1.microchip.com/downloads/en/DeviceDoc/20001936D.pdf>; ALLIED_NUMBER: 70567835; ALLIED_PRICE-STOCK: https://www.alliedelec.com/microchiptechnologyinc-mcp1726t-adje-sn/70567835/; DESCRIPTION: LDO Voltage Regulators 1A CMOS LDO; HEIGHT: 1.75mm; MANUFACTURER_NAME: Microchip; MANUFACTURER_PART_NUMBER: MCP1726T-ADJE/SN; MOUSER_PART_NUMBER: 579-MCP1726T-ADJE/SN; MOUSER_PRICE-STOCK: https://www.mouser.com/Search/Refine.aspx?Keyword=579-MCP1726T-ADJE%2FSN
IC13 = SamacSys_Parts:REF3125AQDBZRQ1: Automotive 20-ppm/C (max), 100-A, 3-pin SOT-23 series voltage reference Source: Datasheet <http://www.ti.com/lit/gpn/ref31-q1>; DESCRIPTION: Automotive 20-ppm/C (max), 100-A, 3-pin SOT-23 series voltage reference; HEIGHT: 1.12mm; MANUFACTURER_NAME: Texas Instruments; MANUFACTURER_PART_NUMBER: REF3125AQDBZRQ1; MOUSER_PART_NUMBER: 595-REF3125AQDBZRQ1; MOUSER_PRICE-STOCK: https://www.mouser.com/Search/Refine.aspx?Keyword=595-REF3125AQDBZRQ1
IC14 = SamacSys_Parts:LM2576HVS-ADJ: TEXAS INSTRUMENTS - LM2576HVS-ADJ - IC, SWITCHING REG 3A ADJ, SMD, 2576 Source: Datasheet <https://componentsearchengine.com/Datasheets/2/LM2576HVS-ADJ.pdf>; DESCRIPTION: TEXAS INSTRUMENTS - LM2576HVS-ADJ - IC, SWITCHING REG 3A ADJ, SMD, 2576; HEIGHT: mm; MANUFACTURER_NAME: Texas Instruments; MANUFACTURER_PART_NUMBER: LM2576HVS-ADJ; MOUSER_PART_NUMBER: 926-LM2576HVS-ADJ; MOUSER_PRICE-STOCK: https://www.mouser.com/Search/Refine.aspx?Keyword=926-LM2576HVS-ADJ
J1 = adafruit:1X2: 3.5mm Terminal block http://www.ladyada.net/library/pcb/eaglelibrary.html
J2 J14 = SparkFun-Connectors:CONN_05X2: Multi connection point. Often used as Generic Header-pin footprint for 0.1 inch spaced/style header connections For AVR SPI programming port, see special device with nice symbol: "AVR_SPI_PROG_5x2.dev" You can populate with any combo of single row headers, but if you'd like an exact match, check these: 2x5 AVR ICSP Male Header <https://www.sparkfun.com/products/778> (PRT-00778) 2x5 Pin Shrouded Header <https://www.sparkfun.com/products/8506> (PRT-08506) On any of the 0.1 inch spaced packages, you can populate with these: Break Away Headers - Straight <https://www.sparkfun.com/products/116> (PRT-00116) Break Away Male Headers - Right Angle <https://www.sparkfun.com/products/553> (PRT-00553) Female Headers <https://www.sparkfun.com/products/115> (PRT-00115) Break Away Headers - Machine Pin <https://www.sparkfun.com/products/117> (PRT-00117) Break Away Female Headers - Swiss Machine Pin <https://www.sparkfun.com/products/743> (PRT-00743) Special note: the shrouded connector mates well with our 5x2 ribbon cables: 2x5 Pin IDC Ribbon Cable <https://www.sparkfun.com/products/8535> (PRT-08535); PROD_ID: CONN-08671; SF_ID: PRT-08506
J3 = SparkFun-Connectors:CONN_20X2: Multi connection point. Often used as Generic Header-pin footprint for 0.1 inch spaced/style header connections On any of the 0.1 inch spaced packages, you can populate with these: Break Away Headers - Straight <https://www.sparkfun.com/products/116> (PRT-00116) Break Away Male Headers - Right Angle <https://www.sparkfun.com/products/553> (PRT-00553) Female Headers <https://www.sparkfun.com/products/115> (PRT-00115) Break Away Headers - Machine Pin <https://www.sparkfun.com/products/117> (PRT-00117) Break Away Female Headers - Swiss Machine Pin <https://www.sparkfun.com/products/743> (PRT-00743); PROD_ID: CONN-12263; SF_ID: CONN-12263
J4-J8 = SparkFun-Connectors:CONN_02: Multi connection point. Often used as Generic Header-pin footprint for 0.1 inch spaced/style header connections On any of the 0.1 inch spaced packages, you can populate with these: Break Away Headers - Straight <https://www.sparkfun.com/products/116> (PRT-00116) Break Away Male Headers - Right Angle <https://www.sparkfun.com/products/553> (PRT-00553) Female Headers <https://www.sparkfun.com/products/115> (PRT-00115) Break Away Headers - Machine Pin <https://www.sparkfun.com/products/117> (PRT-00117) Break Away Female Headers - Swiss Machine Pin <https://www.sparkfun.com/products/743> (PRT-00743) For SCREWTERMINALS and SPRING TERMINALS visit here: Screw Terimnals on SparkFun.com <https://www.sparkfun.com/search/results?term=Screw+Terminals> (5mm/3.5mm/2.54mm spacing) This device is also useful as a general connection point to wire up your design to another part of your project. Our various solder wires solder well into these plated through hole pads. Hook-Up Wire - Assortment (Stranded, 22 AWG) <https://www.sparkfun.com/products/11375> (PRT-11375) Hook-Up Wire - Assortment (Solid Core, 22 AWG) <https://www.sparkfun.com/products/11367> (PRT-11367) View the entire wire category on our website here <https://www.sparkfun.com/categories/141> Special notes: Molex polarized connector foot print use with: PRT-08233 with associated crimp pins and housings. 2.54_SCREWTERM for use with PRT-10571. 3.5mm Screw Terminal footprints for PRT-08084 5mm Screw Terminal footprints for use with PRT-08432
J9 J10 = SparkFun-Connectors:CONN_01: Single connection point. Often used as Generic Header-pin footprint for 0.1 inch spaced/style header connections On any of the 0.1 inch spaced packages, you can populate with these: Break Away Headers - Straight <https://www.sparkfun.com/products/116> (PRT-00116) Break Away Male Headers - Right Angle <https://www.sparkfun.com/products/553> (PRT-00553) Female Headers <https://www.sparkfun.com/products/115> (PRT-00115) Break Away Headers - Machine Pin <https://www.sparkfun.com/products/117> (PRT-00117) Break Away Female Headers - Swiss Machine Pin <https://www.sparkfun.com/products/743> (PRT-00743) This device is also useful as a general connection point to wire up your design to another part of your project. Our various solder wires solder well into these plated through hole pads. Hook-Up Wire - Assortment (Stranded, 22 AWG) <https://www.sparkfun.com/products/11375> (PRT-11375) Hook-Up Wire - Assortment (Solid Core, 22 AWG) <https://www.sparkfun.com/products/11367> (PRT-11367) View the entire wire category on our website here <https://www.sparkfun.com/categories/141> Special notes: SMTSO-256-ET is a "flush mount" nut for a 4-40 screw. We mostly use this on specialty testbeds; it is a nice way to connect hardware to your PCB at an adjustable hieght. Also note, the SNAP packages are for using a snappable style connector. We sell a baggie of snaps and they are also used on two LilyPad designs: Snap Assortment - 30 pack (male and female) <https://www.sparkfun.com/products/11347> (DEV-11347) LilyPad Arduino SimpleSnap <https://www.sparkfun.com/products/10941> (DEV-10941) LilyPad SimpleSnap Protoboard <https://www.sparkfun.com/products/10940> (DEV-10940)
J11-J13 = SparkFun-Connectors:CONN_03: Multi connection point. Often used as Generic Header-pin footprint for 0.1 inch spaced/style header connections On any of the 0.1 inch spaced packages, you can populate with these: Break Away Headers - Straight <https://www.sparkfun.com/products/116> (PRT-00116) Break Away Male Headers - Right Angle <https://www.sparkfun.com/products/553> (PRT-00553) Female Headers <https://www.sparkfun.com/products/115> (PRT-00115) Break Away Headers - Machine Pin <https://www.sparkfun.com/products/117> (PRT-00117) Break Away Female Headers - Swiss Machine Pin <https://www.sparkfun.com/products/743> (PRT-00743) Stackable Header - 3 Pin (Female, 0.1") <https://www.sparkfun.com/products/13875> (PRT-13875) For SCREWTERMINALS and SPRING TERMINALS visit here: Screw Terimnals on SparkFun.com <https://www.sparkfun.com/search/results?term=Screw+Terminals> (5mm/3.5mm/2.54mm spacing) This device is also useful as a general connection point to wire up your design to another part of your project. Our various solder wires solder well into these plated through hole pads. Hook-Up Wire - Assortment (Stranded, 22 AWG) <https://www.sparkfun.com/products/11375> (PRT-11375) Hook-Up Wire - Assortment (Solid Core, 22 AWG) <https://www.sparkfun.com/products/11367> (PRT-11367) View the entire wire category on our website here <https://www.sparkfun.com/categories/141> Special notes: Molex polarized connector foot print use with SKU : PRT-08232 with associated crimp pins and housings.
L1 = SamacSys_Parts:SRR1260-680M: Power inductor SMD shielded 68uH 2.1A Bourns SRR1260 Series Shielded Wire-wound SMD Inductor with a Ferrite Core, 68 uH +/-20% 2.1A Idc Q:22 Source: Datasheet <https://componentsearchengine.com/Datasheets/2/SRR1260-680M.pdf>; ALLIED_NUMBER: 70277070; ALLIED_PRICE-STOCK: https://www.alliedelec.com/bourns-srr1260-680m/70277070/; DESCRIPTION: Power inductor SMD shielded 68uH 2.1A Bourns SRR1260 Series Shielded Wire-wound SMD Inductor with a Ferrite Core, 68 uH +/-20% 2.1A Idc Q:22; HEIGHT: 6.5mm; MANUFACTURER_NAME: Bourns; MANUFACTURER_PART_NUMBER: SRR1260-680M; MOUSER_PART_NUMBER: 652-SRR1260-680M; MOUSER_PRICE-STOCK: https://www.mouser.com/Search/Refine.aspx?Keyword=652-SRR1260-680M; RS_PART_NUMBER: 7272243P; RS_PRICE-STOCK: http://uk.rs-online.com/web/p/products/7272243P
LED1 = adafruit:LED: LED OSRAM: - CHIPLED LG R971, LG N971, LY N971, LG Q971, LY Q971, LO R971, LY R971 LH N974, LH R974 LS Q976, LO Q976, LY Q976 LO Q996 - Hyper CHIPLED LW Q18S LB Q993, LB Q99A, LB R99A - SideLED LS A670, LO A670, LY A670, LG A670, LP A670 LB A673, LV A673, LT A673, LW A673 LH A674 LY A675 LS A676, LA A676, LO A676, LY A676, LW A676 LS A679, LY A679, LG A679 - Hyper Micro SIDELED® LS Y876, LA Y876, LO Y876, LY Y876 LT Y87S - SmartLED LW L88C, LW L88S LB L89C, LB L89S, LG L890 LS L89K, LO L89K, LY L89K LS L896, LA L896, LO L896, LY L896 - TOPLED LS T670, LO T670, LY T670, LG T670, LP T670 LSG T670, LSP T670, LSY T670, LOP T670, LYG T670 LG T671, LOG T671, LSG T671 LB T673, LV T673, LT T673, LW T673 LH T674 LS T676, LA T676, LO T676, LY T676, LB T676, LH T676, LSB T676, LW T676 LB T67C, LV T67C, LT T67C, LS T67K, LO T67K, LY T67K, LW E67C LS E67B, LA E67B, LO E67B, LY E67B, LB E67C, LV E67C, LT E67C LW T67C LS T679, LY T679, LG T679 LS T770, LO T770, LY T770, LG T770, LP T770 LB T773, LV T773, LT T773, LW T773 LH T774 LS E675, LA E675, LY E675, LS T675 LS T776, LA T776, LO T776, LY T776, LB T776 LHGB T686 LT T68C, LB T68C - Hyper Mini TOPLED® LB M676 - Mini TOPLED Santana® LG M470 LS M47K, LO M47K, LY M47K Source: http://www.osram.convergy.de/
Q1 = adafruit:ELECTRET: Electret microphone Thru hole 2.54mm spacing with 9.7mm diameter
Q2 = adafruit:CRYSTAL: CRYSTAL; OC_FARNELL: unknown; OC_NEWARK: unknown
TP$1 = MyLibrary:TEST_POINT: Test Point for the black and white pins @ the ResiStore: https://resi.store/inventory/item.php?plu=1069
U$1 = adafruit:2.1MMJACK: 2.1mm x 5.5mm THM DC jack with internal switch. Digikey part #PJ-102A, 4UCON part #05537 2.1mm x 5.5mm SMT DC jack with internal switch. Digikey part #PJ-002A-SMT, 4UCON part #03267 By microbuilder.eu & adafruit.com
VR1 = SparkFun-Resistors:TRIMPOT: Trimming Potentiometer (Trimpot) Three-terminal potentiometers, with an adjustable wiper and two adjustable resistors. A pot can be used to create a configurable voltage divider, or as a variable resistor. "Trimpots" are a subset of potentiometers, usually intended for "set-and-forget" applications. They're often more delicate than standard potentiometers - rated for fewer turns. Variants PTH-KNOB - PTH Trimpot w/ finger-adjustable knob Trimpot 10K with Knob <https://www.sparkfun.com/products/9806> (COM-09806) Datasheet <http://www.sparkfun.com/datasheets/Components/General/TSR-3386.pdf> SMD-3MM-CLOSED-FRAME - SMD 3mm Square Closed-Frame Trimpot Used on e.g. EasyDriver - Stepper Motor Driver <https://www.sparkfun.com/products/12779> Datasheet <http://www.bitechnologies.com/pdfs/22.pdf> (22AR10KTR) SMD-5MM - SMD 5mm Square Closed-Frame Trimpot Used on e.g. IOIO-OTG - V2.2 <https://www.sparkfun.com/products/13613> Datasheet <http://www.vishay.com/docs/51008/ts53.pdf> (TS53YL502MR10) SMD-3MM-1/10W-25% - 3mm Square Open-Frame Trimpot Used on e.g. SparkFun Shapeoko <https://www.sparkfun.com/products/13899> Datasheet <http://www.bourns.com/docs/Product-Datasheets/TC33.pdf> (TC33X-2-103E); PROD_ID: RES-09730; SF_SKU: COM-09806

## Module POWER_SUPPLY
Ports: 

### Library data of the parts